# EAGLE design computer (EAGLE 7.1.0)
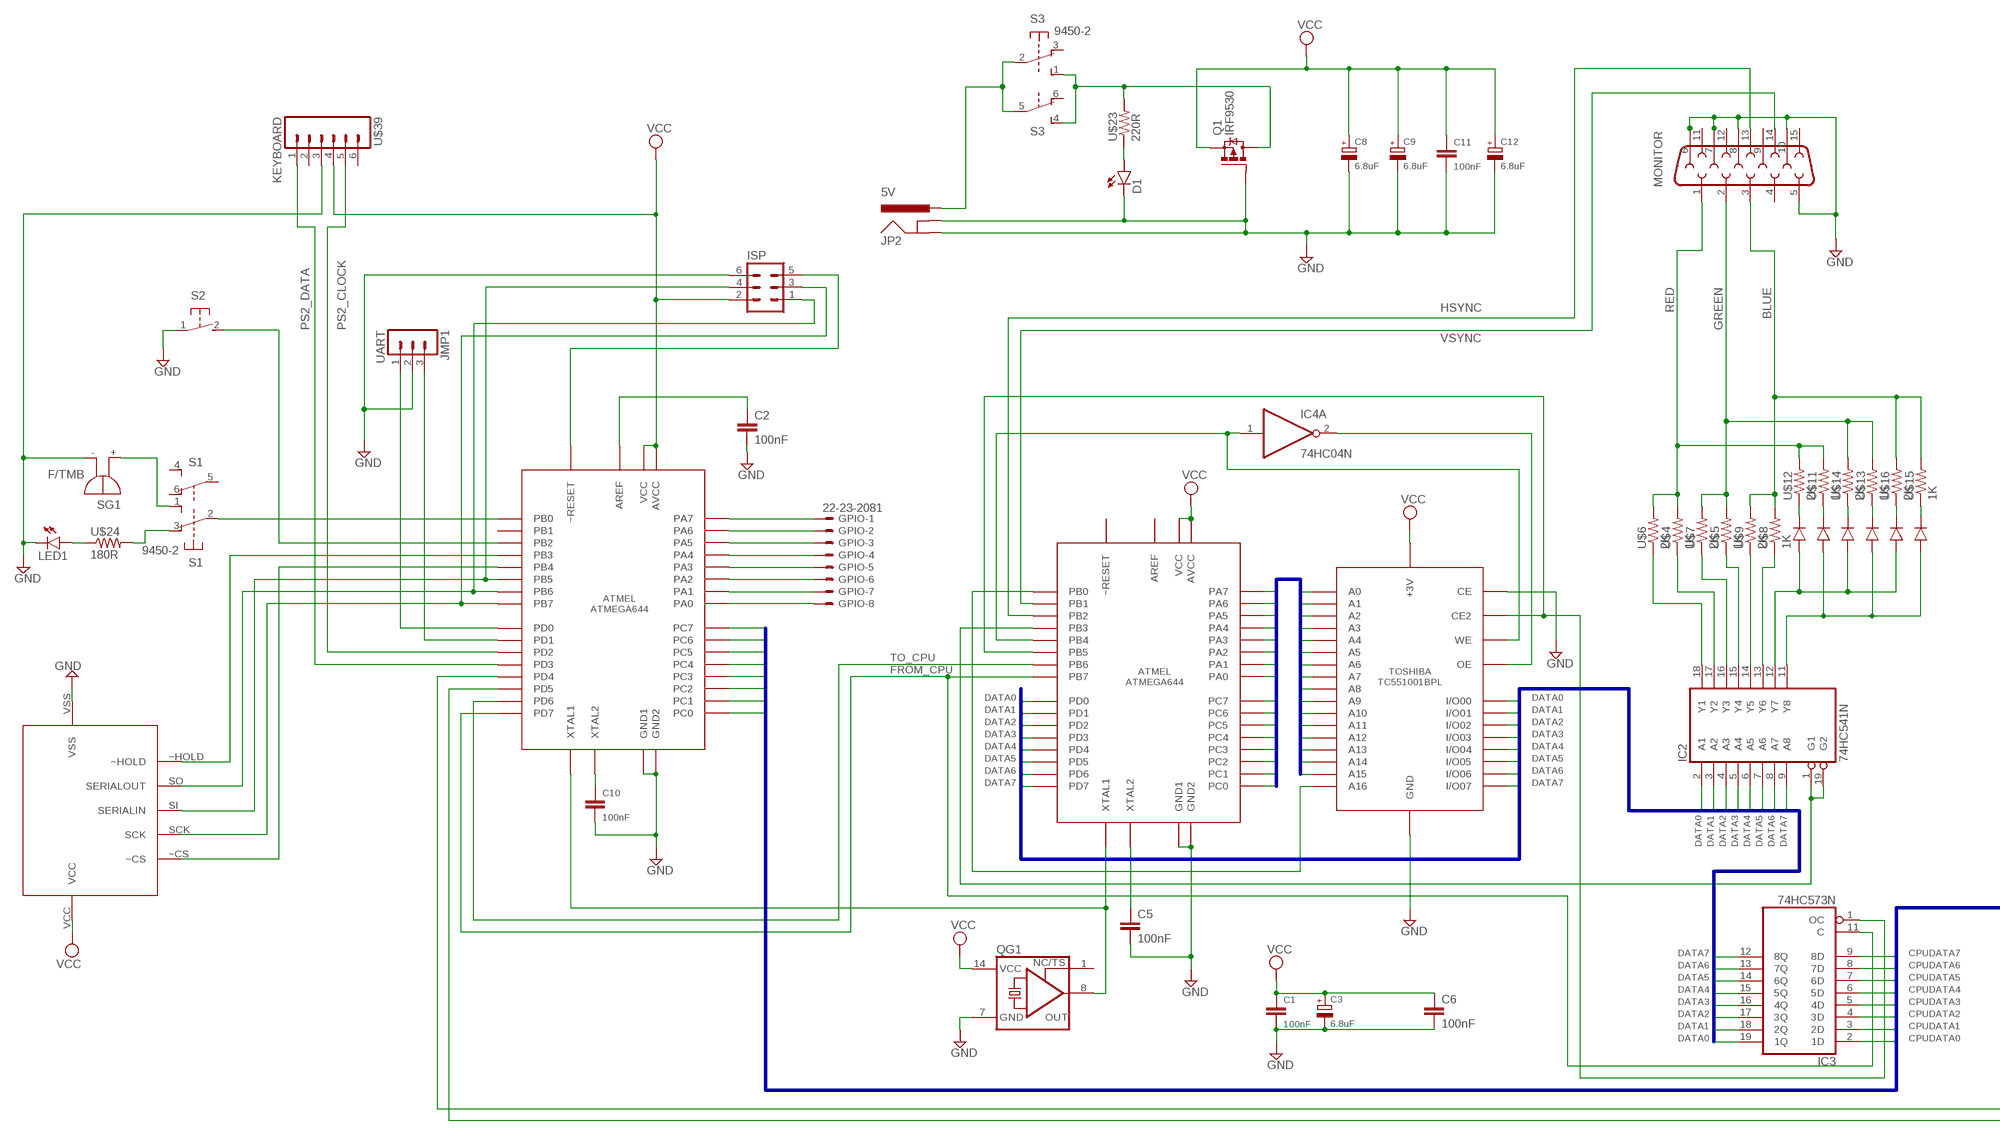
[diagram p0: schematic, sheet 1, part 1 of 2]
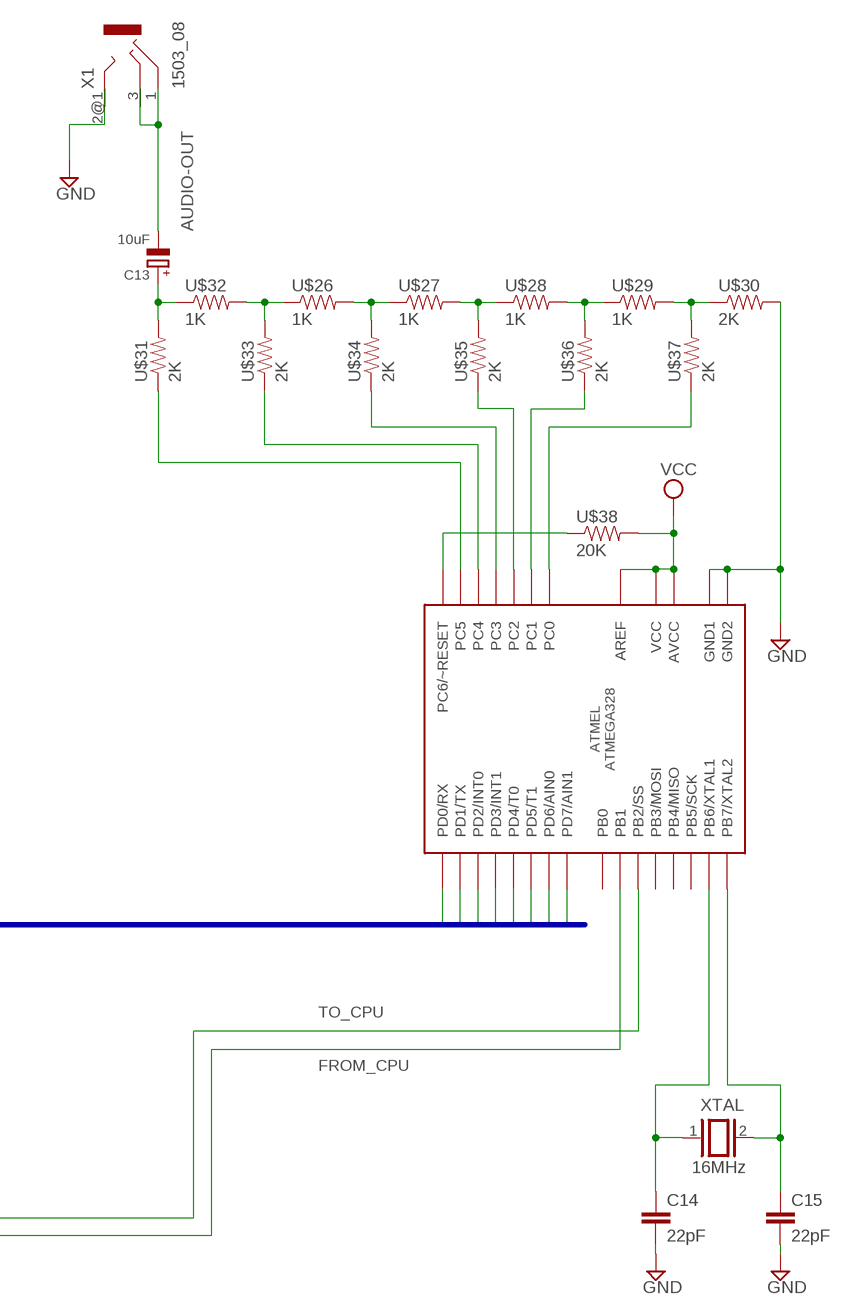
[diagram p1: schematic, sheet 1, part 2 of 2]

## Parts
C1  100nF  C5/2.5  [C5B2.5]
C2  100nF  CAPEZ  [CAP-PTH-SMALLEZ]
C3  6.8uF  CPOL-EUE5-5  [E5-5]
C5  100nF  CAPEZ  [CAP-PTH-SMALLEZ]
C6  100nF  CAPEZ  [CAP-PTH-SMALLEZ]
C8  6.8uF  CPOL-EUE5-5  [E5-5]
C9  6.8uF  CPOL-EUE5-5  [E5-5]
C10  100nF  C5/2.5  [C5B2.5]
C11  100nF  C5/2.5  [C5B2.5]
C12  6.8uF  CPOL-EUE5-5  [E5-5]
C13  10uF  CPOL-EUE5-5  [E5-5]
C14  22pF  CAPEZ  [CAP-PTH-SMALLEZ]
C15  22pF  CAPEZ  [CAP-PTH-SMALLEZ]
D1  LED5MM  [LED5MM]
GPIO  22-23-2081  [22-23-2081]
IC2  74HC541N  [DIL20]
IC3  74HC573N  [DIL20]
IC4  74HC04N  [DIL14]
ISP  ML6  [ML6]
JMP1  UART  MA03-1  [MA03-1]
JP2  5V  POWER_JACKPTH  [POWER_JACK_PTH]
LED1  LED5MM  [LED5MM]
Q1  IRF9530  [TO220BV]
QG1  XO-14  [DIL14S]
S1  9450-2  [9450-2]
S2  31-XX  [B3F-31XX]
S3  9450-2  [9450-2]
SG1  F/TMB  [F/TMB]
U$1  ATMEGA644  [ATMEGA644]
U$2  ATMEGA644  [ATMEGA644]
U$3  TC551001BPL  [TC551001BPL]
U$4  1K  RESISTOREZ  [AXIAL-0.3EZ]
U$5  1K  RESISTOREZ  [AXIAL-0.3EZ]
U$6  2K  RESISTOREZ  [AXIAL-0.3EZ]
U$7  2K  RESISTOREZ  [AXIAL-0.3EZ]
U$8  1K  RESISTOREZ  [AXIAL-0.3EZ]
U$9  2K  RESISTOREZ  [AXIAL-0.3EZ]
U$10  23LC1024  [23LC1024]
U$11  1K  RESISTOREZ  [AXIAL-0.3EZ]
U$12  2K  RESISTOREZ  [AXIAL-0.3EZ]
U$13  1K  RESISTOREZ  [AXIAL-0.3EZ]
U$14  2K  RESISTOREZ  [AXIAL-0.3EZ]
U$15  1K  RESISTOREZ  [AXIAL-0.3EZ]
U$16  2K  RESISTOREZ  [AXIAL-0.3EZ]
U$17  DIODE  [DIODE]
U$18  DIODE  [DIODE]
U$19  DIODE  [DIODE]
U$20  DIODE  [DIODE]
U$21  DIODE  [DIODE]
U$22  DIODE  [DIODE]
U$23  220R  RESISTOREZ  [AXIAL-0.3EZ]
U$24  180R  RESISTOREZ  [AXIAL-0.3EZ]
U$25  ATMEGA328  [ATMEGA328]
U$26  1K  RESISTOREZ  [AXIAL-0.3EZ]
U$27  1K  RESISTOREZ  [AXIAL-0.3EZ]
U$28  1K  RESISTOREZ  [AXIAL-0.3EZ]
U$29  1K  RESISTOREZ  [AXIAL-0.3EZ]
U$30  2K  RESISTOREZ  [AXIAL-0.3EZ]
U$31  2K  RESISTOREZ  [AXIAL-0.3EZ]
U$32  1K  RESISTOREZ  [AXIAL-0.3EZ]
U$33  2K  RESISTOREZ  [AXIAL-0.3EZ]
U$34  2K  RESISTOREZ  [AXIAL-0.3EZ]
U$35  2K  RESISTOREZ  [AXIAL-0.3EZ]
U$36  2K  RESISTOREZ  [AXIAL-0.3EZ]
U$37  2K  RESISTOREZ  [AXIAL-0.3EZ]
U$38  20K  RESISTOREZ  [AXIAL-0.3EZ]
U$39  KEYBOARD  MINI-DIN6PTH  [MINI-DIN6]
U$40  MONITOR  DB15  [DB15]
X1  1503_08  [1503_08]
XTAL  16MHz  XTAL/S  [QS]

## Nets
ADDRESS0: U$2.PC0 U$3.A0
ADDRESS1: U$2.PC1 U$3.A1
ADDRESS2: U$2.PC2 U$3.A2
ADDRESS3: U$2.PC3 U$3.A3
ADDRESS4: U$2.PC4 U$3.A4
ADDRESS5: U$2.PC5 U$3.A5
ADDRESS6: U$2.PC6 U$3.A6
ADDRESS7: U$2.PC7 U$3.A7
ADDRESS8: U$2.PA0 U$3.A8
ADDRESS9: U$2.PA1 U$3.A9
ADDRESS10: U$2.PA2 U$3.A10
ADDRESS11: U$2.PA3 U$3.A11
ADDRESS12: U$2.PA4 U$3.A12
ADDRESS13: U$2.PA5 U$3.A13
ADDRESS14: U$2.PA6 U$3.A14
ADDRESS15: U$2.PA7 U$3.A15
AUDIO-OUT: C13.- X1.1 X1.3
BLUE: U$8.P$2 U$9.P$2 U$15.P$2 U$16.P$2 U$40.3
CPUDATA0: IC3.2(1D) U$1.PC0 U$25.PD0/RX
CPUDATA1: IC3.3(2D) U$1.PC1 U$25.PD1/TX
CPUDATA2: IC3.4(3D) U$1.PC2 U$25.PD2/INT0
CPUDATA3: IC3.5(4D) U$1.PC3 U$25.PD3/INT1
CPUDATA4: IC3.6(5D) U$1.PC4 U$25.PD4/T0
CPUDATA5: IC3.7(6D) U$1.PC5 U$25.PD5(PD5/T1)
CPUDATA6: IC3.8(7D) U$1.PC6 U$25.PD6(PD6/AIN0)
CPUDATA7: IC3.9(8D) U$1.PC7 U$25.PD7(PD7/AIN1)
DATA0: IC2.2(A1) IC3.19(1Q) U$2.PD0 U$3.I/O1(I/O00)
DATA1: IC2.3(A2) IC3.18(2Q) U$2.PD1 U$3.I/O2(I/O01)
DATA2: IC2.4(A3) IC3.17(3Q) U$2.PD2 U$3.I/O3(I/O02)
DATA3: IC2.5(A4) IC3.16(4Q) U$2.PD3 U$3.I/O4(I/O03)
DATA4: IC2.6(A5) IC3.15(5Q) U$2.PD4 U$3.I/O5(I/O04)
DATA5: IC2.7(A6) IC3.14(6Q) U$2.PD5 U$3.I/O6(I/O05)
DATA6: IC2.8(A7) IC3.13(7Q) U$2.PD6 U$3.I/O7(I/O06)
DATA7: IC2.9(A8) IC3.12(8Q) U$2.PD7 U$3.I/O8(I/O07)
FROM_CPU: IC3.11(C) U$1.PD5 U$1.PD7 U$2.PB7 U$25.PB1
GND: C1.2 C2.2 C3.- C5.2 C6.2 C8.- C9.- C10.2 C11.2 C12.- C14.2 C15.2 D1.K(C) ISP.6 JMP1.2 JP2.GND JP2.GNDBREAK LED1.K(C) Q1.G QG1.7(GND) S2.1(P) SG1.- U$1.GND(GND1) U$1.GND.1(GND2) U$2.GND(GND1) U$2.GND.1(GND2) U$3.GND U$3.~CE1(CE) U$10.VSS U$25.GND1(GND2) U$25.GND(GND1) U$30.P$2 U$39.3 U$40.5 U$40.6 U$40.7 U$40.8 U$40.10 X1.2@1 X1.2@2
GREEN: U$5.P$2 U$7.P$2 U$13.P$2 U$14.P$2 U$40.2
HSYNC: U$2.PB2 U$40.13
N$1: QG1.8(OUT) U$1.XTAL1 U$2.XTAL1
N$2: U$12.P$1 U$17.CA(CATHODE)
N$3: IC4.2(A:O) U$3.~OE(OE)
N$4: GPIO.1 U$1.PA7
N$5: U$2.PB0 U$3.A16
N$6: IC2.1(G1) IC2.19(G2) U$2.PB3
N$7: C5.1 U$2.XTAL2
N$8: IC3.1(OC) U$2.PB5 U$3.CE2
N$9: C13.+ U$31.P$2 U$32.P$1
N$10: IC4.1(A:I) U$2.PB4 U$3.R/W(WE)
N$11: C10.1 U$1.XTAL2
N$12: U$11.P$1 U$18.CA(CATHODE)
N$13: U$14.P$1 U$19.CA(CATHODE)
N$14: U$13.P$1 U$20.CA(CATHODE)
N$15: U$16.P$1 U$21.CA(CATHODE)
N$16: U$15.P$1 U$22.CA(CATHODE)
N$17 [vcc]: JP2.PWR S3.2(1:P) S3.5(2:P)
N$18: S1.1(1:S) SG1.+
N$19: S1.3(1:O) U$24.P$2
N$20: LED1.A U$24.P$1
N$21: S1.2(1:P) U$1.PB0
N$22: JMP1.1 U$1.PD0
N$23: IC2.18(Y1) U$6.P$1
N$24: IC2.17(Y2) U$4.P$1
N$25: IC2.16(Y3) U$7.P$1
N$26: IC2.15(Y4) U$5.P$1
N$27: IC2.14(Y5) U$9.P$1
N$28: IC2.13(Y6) U$8.P$1
N$29: IC2.12(Y7) U$17.AN(ANODE) U$19.AN(ANODE) U$21.AN(ANODE)
N$30: IC2.11(Y8) U$18.AN(ANODE) U$20.AN(ANODE) U$22.AN(ANODE)
N$31: U$26.P$1 U$32.P$2 U$33.P$2
N$32: U$26.P$2 U$27.P$1 U$34.P$2
N$33: U$27.P$2 U$28.P$1 U$35.P$2
N$34: U$28.P$2 U$29.P$1 U$36.P$2
N$35: U$29.P$2 U$30.P$1 U$37.P$2
N$36: U$25.PC5/ADC5(PC5) U$31.P$1
N$37: U$25.PC4/ADC4(PC4) U$33.P$1
N$38: U$25.PC3/ADC3(PC3) U$34.P$1
N$39: U$25.PC2/ADC2(PC2) U$35.P$1
N$40: U$25.PC1/ADC1(PC1) U$36.P$1
N$41: U$25.PC0/ADC0(PC0) U$37.P$1
N$42: U$25.PC6/RESET(PC6/~RESET) U$38.P$1
N$43: C14.1 U$25.PB6(PB6/XTAL1) XTAL.1
N$44: C15.1 U$25.PB7(PB7/XTAL2) XTAL.2
N$45: C2.1 U$1.AREF
N$47: JMP1.3 U$1.PD1
N$48: ISP.3 U$1.PB7 U$10.SCK
N$49: S2.2(S) U$1.PB2
N$50: ISP.1 U$1.PB6 U$10.SO(SERIALOUT)
N$51: ISP.4 U$1.PB5 U$10.SI(SERIALIN)
N$52: U$1.PB4 U$10.~CS
N$53: U$1.PB3 U$10.~HOLD
N$54: GPIO.2 U$1.PA6
N$55: GPIO.3 U$1.PA5
N$56: GPIO.4 U$1.PA4
N$57: GPIO.5 U$1.PA3
N$58: GPIO.6 U$1.PA2
N$59: GPIO.7 U$1.PA1
N$60: GPIO.8 U$1.PA0
N$61: ISP.5 U$1.~RESET
N$64 [vcc]: Q1.D S3.1(1:S) S3.4(2:S) U$23.P$2
N$69: D1.A U$23.P$1
PS2_CLOCK: U$1.PD2 U$39.5
PS2_DATA: U$1.PD3 U$39.1
RED: U$4.P$2 U$6.P$2 U$11.P$2 U$12.P$2 U$40.1
TO_CPU: U$1.PD4 U$1.PD6 U$2.PB6 U$25.PB2/SS
VCC [vcc]: C1.1 C3.+ C6.1 C8.+ C9.+ C11.1 C12.+ ISP.2 Q1.S QG1.14(VCC) U$1.AVCC U$1.VCC U$2.AVCC U$2.VCC U$3.VDD(+3V) U$10.VCC U$25.AREF U$25.AVCC U$25.VCC U$38.P$2 U$39.4
VSYNC: U$2.PB1 U$40.14
Unconnected: IC4.3(B:I) IC4.4(B:O) IC4.5(C:I) IC4.6(C:O) IC4.8(D:O) IC4.9(D:I) IC4.10(E:O) IC4.11(E:I) IC4.12(F:O) IC4.13(F:I) QG1.1(TS) S1.4(2:S) S1.5(2:P) S1.6(2:O) S3.3(1:O) S3.6(2:O) U$1.PB1 U$2.AREF U$2.~RESET U$25.PB0 U$25.PB3/MOSI U$25.PB4/MISO U$25.PB5/SCK U$39.2 U$39.6 U$40.4 U$40.9 U$40.11 U$40.12 U$40.15

## Buses
DATA[0..7]
ADDRESS[0..15]
CPUDATA[0..7]

## Power pins joined to a net without a drawn wire
GND: IC2.10(GND) IC3.10(GND) IC4.7(P:GND)
VCC: IC2.20(VCC) IC3.20(VCC) IC4.14(P:VCC)

## Library data of the parts
C1 C10 C11 = capacitor-wima:C: CAPACITOR naming: grid - package width
C2 C5 C6 = SparkFun-Capacitors:CAP: Capacitor Standard 0603 ceramic capacitor, and 0.1" leaded capacitor.
C3 C8 C9 C12 C13 = rcl:CPOL-EU: POLARIZED CAPACITOR, European symbol
C14 C15 = SparkFun-Passives:CAP: Capacitor Standard 0603 ceramic capacitor, and 0.1" leaded capacitor.
D1 LED1 = SparkFun-LED:LED: LEDs Standard schematic elements and footprints for 5mm, 3mm, 1206, and 0603 sized LEDs. 5mm - Spark Fun Electronics SKU : COM-00529 (and others)
GPIO = con-molex:22-23-2081: .100" (2.54mm) Center Header - 8 Pin; MF: MOLEX; MPN: 22-23-2081; OC_FARNELL: 1756826; OC_NEWARK: 01C7592
IC2 = 74xx-eu:74*541: Octal BUFFER and LINE DRIVER, 3-state
IC3 = 74xx-eu:74*573: 8-bit D latch BUS DRIVER
IC4 = 74xx-eu:74*04: Hex INVERTER
ISP = con-ml:ML6: HARTING; OC_FARNELL: unknown; OC_NEWARK: unknown
JMP1 = con-lstb:MA03-1: PIN HEADER; OC_FARNELL: unknown; OC_NEWARK: unknown
JP2 = SparkFun-Connectors:POWER_JACK: Power Jack This is the standard 5.5mm barrel jack for power. The PTH is the most common, proven, reliable, footprint. The Slot footprint only works if the mill layer is transmitted to the PCB fab house so be warned. Mating wall wart : TOL-00298 (and others); PROD_ID: CONN-08197
Q1 = transistor-power:IRF9530: P-CHANNEL HEXFET POWER-MOS-FET Source: http://www.irf.com/product-info/datasheets/data/irf9530.pdf
QG1 = crystal:XO-: CRYSTAL; OC_FARNELL: unknown; OC_NEWARK: unknown
S1 S3 = switch-misc:9450-2: MARQUARDT SWITCH
S2 = switch-omron:31-XX: OMRON SWITCH; MPN: B3F-3100; OC_FARNELL: 959704; OC_NEWARK: 36M3582
SG1 = buzzer:F/TMB: BUZZER Source: Buerklin; OC_FARNELL: unknown; OC_NEWARK: unknown
U$1 U$2 = pvar_parts:ATMEGA644
U$3 = pvar_parts:TC551001BPL
U$4-U$9 U$11-U$16 U$23 U$24 U$26-U$38 = SparkFun-Resistors:RESISTOR: Resistor Basic schematic elements and footprints for 0603, 1206, and PTH resistors.
U$10 = pvar_parts:23LC1024: SPI SRAM 128K x 8bit
U$17-U$22 = pvar_parts:DIODE
U$25 = pvar_parts:ATMEGA328
U$39 = SparkFun-Connectors:MINI-DIN6: mini DIN 6 Connector Commonly found on the back of a computer for PS2 keyboard and mice. Schematic and footprint are proven. Spark Fun Electronics SKU : PRT-08509
U$40 = SparkFun-Connectors:DB15: DB15 / VGA right angle through-hole female connector.
X1 = con-lumberg:1503_?: Jack connectors according to JISC 6560, 3.5 mm Klinkensteckverbinder nach JISC 6560, 3,5 mm Source: http://www.lumberg.com/Produkte/PDFs/1503_08.pdf; OC_FARNELL: unknown; OC_NEWARK: unknown
XTAL = special:XTAL/S: CRYSTAL

## Net classes
1 vcc: width 0.381 mm

## Board
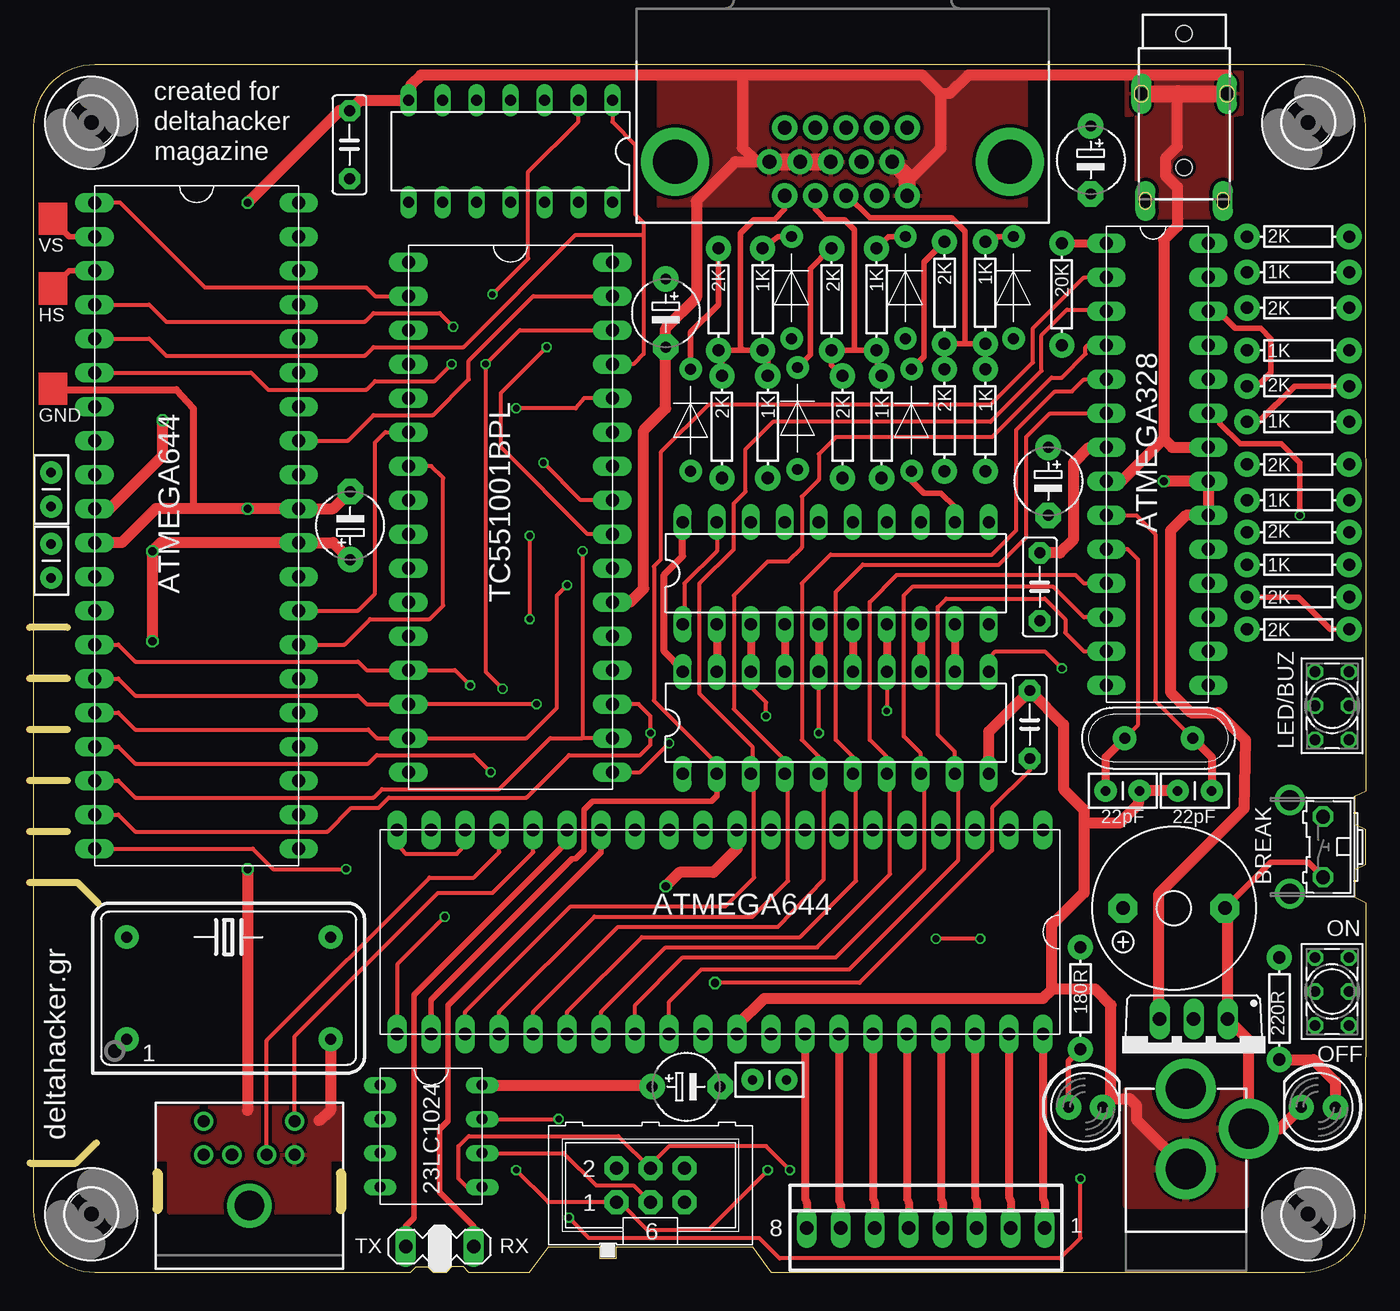
[diagram p2: board, top side]
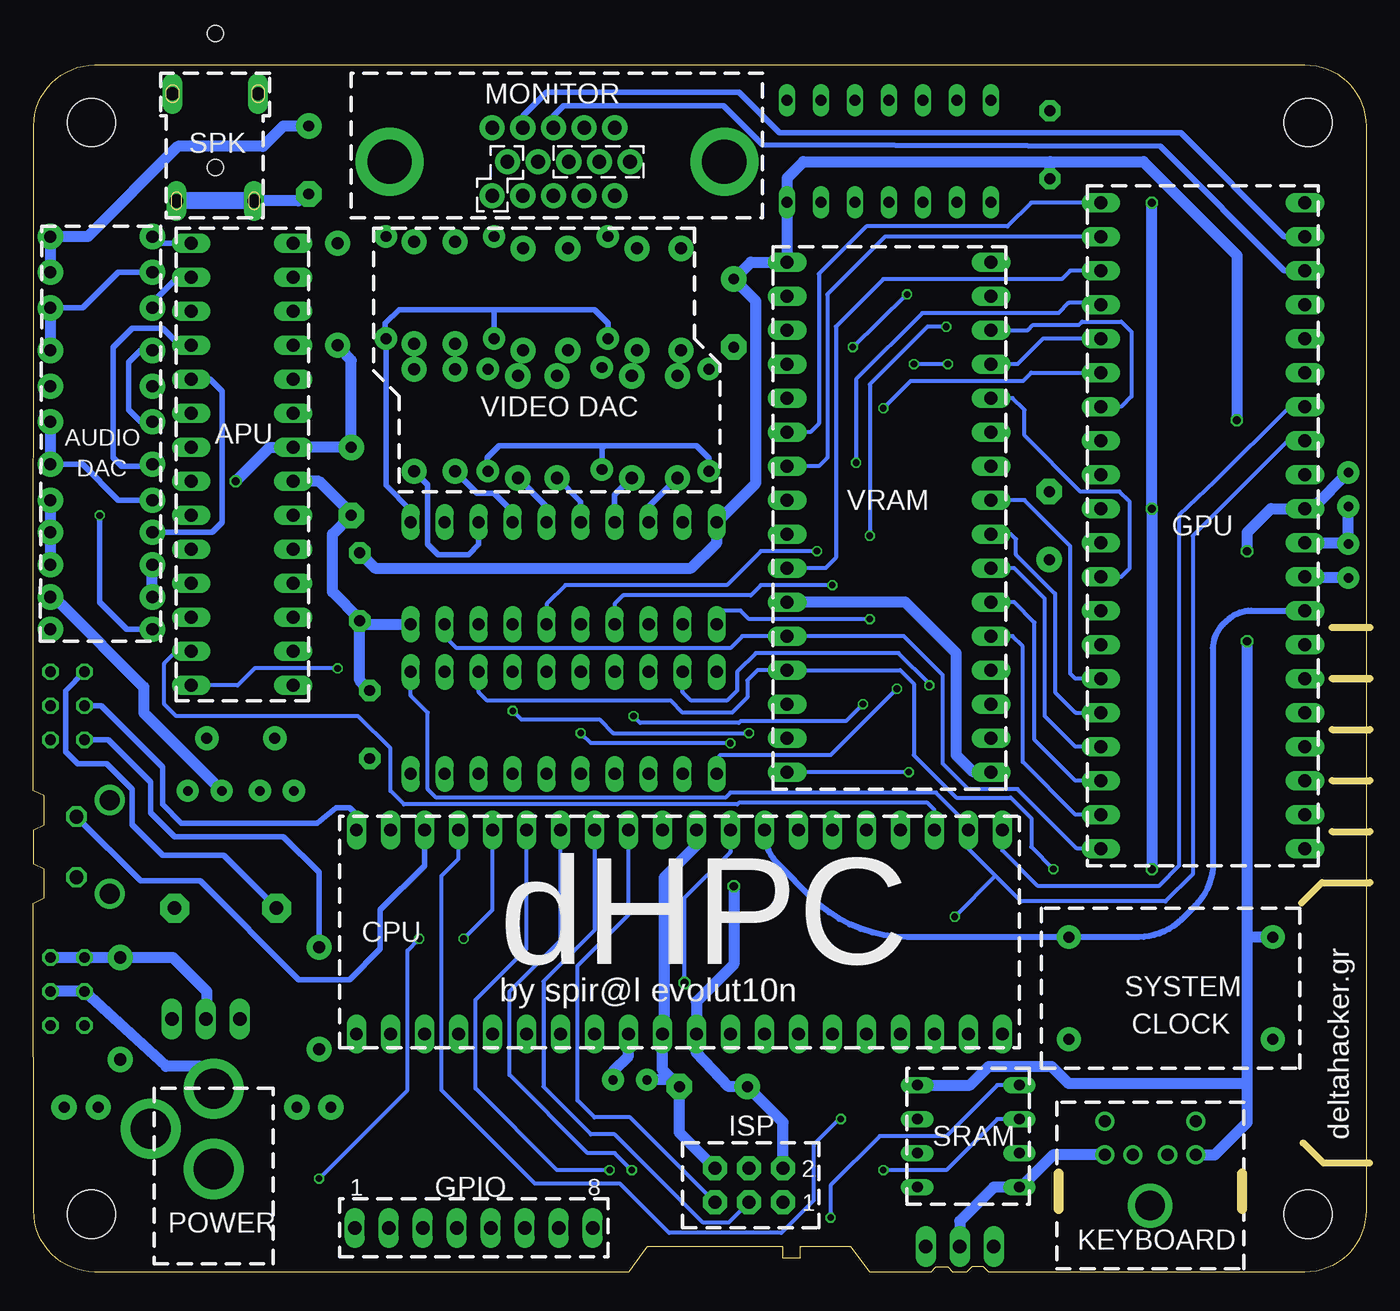
[diagram p3: board, bottom side, seen from below]

Size 99.57 x 90.17 mm. Coordinates in mm from the lower left corner, seen from the top.
Outline: 26.8,90.17 4.57,90.17 arc90 0,85.6 0,4.57 arc90 4.57,0 28.19,0 28.57,0.38 29.46,0.38 29.84,0 30.86,0 31.24,0.38 32.13,0.38 32.51,0 37.08,0 38.48,1.9 42.29,1.9 42.29,1.02 43.56,1.02 43.56,1.9 53.72,1.9 55.12,0 94.98,0 arc90 99.55,4.57 99.57,27.56 98.75,27.94 98.75,30.1 99.55,30.46 99.55,33.04 98.75,33.4 98.75,35.56 99.57,35.94 99.55,85.6 arc90 94.98,90.17 26.8,90.17
Copper layers (1*16): Top 0.018mm / dielectric 1.55mm / Bottom 0.018mm
Design rules "eC_2Layer_PClass6_BaseCopperO18_eCDefault": minimum track width 0.15mm, minimum drill 0.35mm, track to track 0.15mm, track to pad 0.15mm, pad to pad 0.15mm, via to via 0.15mm, smd to smd 0mil, copper to edge 0.25mm, drill to drill 0.35mm, minimum pad ring 0.175mm, minimum via ring 0.125mm, stop-mask expansion 0mil, vias tented up to drill 0.45mm, thermal gap 0.2mm
Milling: 12 lines

### Footprints (pad centres in the part's own frame; a part is rotated, then mirrored left to right if it is on the bottom)
C5B2.5 = drill 0.813 pad 1.6 octagon: 1 -2.54,0; 2 2.54,0
CAP-PTH-SMALLEZ = drill 0.7 pad 1.651: 1 0,0; 2 2.54,0
E5-5 = drill 0.813 pad 1.905: + -2.54,0 | drill 0.813 pad 1.905 octagon: - 2.54,0
LED5MM = drill 0.813 pad 1.88: A -1.27,0; K 1.27,0
22-23-2081 = drill 1 long: 1 -8.89,0; 2 -6.35,0; 3 -3.81,0; 4 -1.27,0; 5 1.27,0; 6 3.81,0; 7 6.35,0; 8 8.89,0
3,6 = hole 3.6: 0,0
DIL20 = drill 0.9 long: 1 -11.43,-3.81; 2 -8.89,-3.81; 3 -6.35,-3.81; 4 -3.81,-3.81; 5 -1.27,-3.81; 6 1.27,-3.81; 7 3.81,-3.81; 8 6.35,-3.81; 9 8.89,-3.81; 10 11.43,-3.81; 11 11.43,3.81; 12 8.89,3.81; 13 6.35,3.81; 14 3.81,3.81; 15 1.27,3.81; 16 -1.27,3.81; 17 -3.81,3.81; 18 -6.35,3.81; 19 -8.89,3.81; 20 -11.43,3.81
DIL14 = drill 0.813 long: 1 -7.62,-3.81; 2 -5.08,-3.81; 3 -2.54,-3.81; 4 0,-3.81; 5 2.54,-3.81; 6 5.08,-3.81; 7 7.62,-3.81; 8 7.62,3.81; 9 5.08,3.81; 10 2.54,3.81; 11 0,3.81; 12 -2.54,3.81; 13 -5.08,3.81; 14 -7.62,3.81
ML6 = drill 0.991 pad 1.778 octagon: 1 -2.54,-1.27; 2 -2.54,1.27; 3 0,-1.27; 4 0,1.27; 5 2.54,-1.27; 6 2.54,1.27
MA03-1 = drill 1.016 long: 1 -2.54,0; 2 0,0; 3 2.54,0
POWER_JACK_PTH = drill 2.997 pad 4.318: GND 0,7.7; GNDBREAK 4.7,10.7; PWR 0,13.7
TO220BV = drill 1.016 long: D 0,-2.54; G -2.54,-2.54; S 2.54,-2.54
DIL14S = drill 0.813 pad 1.778: 1 -7.62,-3.81; 7 7.62,-3.81; 8 7.62,3.81; 14 -7.62,3.81
9450-2 = drill 0.813 octagon: 1 -2.54,-1.27; 2 0,-1.27; 3 2.54,-1.27; 4 -2.54,1.27; 5 0,1.27; 6 2.54,1.27
B3F-31XX = drill 1.016 octagon: 1 -2.261,-1.245; 2 2.261,-1.245 | drill 1.499 pad 2.159: 3 -3.505,1.245; 4 3.505,1.245
F/TMB = drill 1.016 pad 2.159 octagon: + 3.81,0; - -3.81,0
ATMEGA644 = drill 0.965 long: AREF 7.62,2.54; AVCC 7.62,-2.54; GND -7.62,-2.54; GND.1 7.62,0; PA0 7.62,22.86; PA1 7.62,20.32; PA2 7.62,17.78; PA3 7.62,15.24; PA4 7.62,12.7; PA5 7.62,10.16; PA6 7.62,7.62; PA7 7.62,5.08; PB0 -7.62,22.86; PB1 -7.62,20.32; PB2 -7.62,17.78; PB3 -7.62,15.24; PB4 -7.62,12.7; PB5 -7.62,10.16; PB6 -7.62,7.62; PB7 -7.62,5.08; PC0 7.62,-22.86; PC1 7.62,-20.32; PC2 7.62,-17.78; PC3 7.62,-15.24; PC4 7.62,-12.7; PC5 7.62,-10.16; PC6 7.62,-7.62; PC7 7.62,-5.08; PD0 -7.62,-10.16; PD1 -7.62,-12.7; PD2 -7.62,-15.24; PD3 -7.62,-17.78; PD4 -7.62,-20.32; PD5 -7.62,-22.86; PD6 -7.62,-25.4; PD7 7.62,-25.4; VCC -7.62,0; XTAL1 -7.62,-7.62; XTAL2 -7.62,-5.08; ~RESET -7.62,2.54
TC551001BPL = drill 0.965 long: A0 -7.62,-10.16; A1 -7.62,-7.62; A2 -7.62,-5.08; A3 -7.62,-2.54; A4 -7.62,0; A5 -7.62,2.54; A6 -7.62,5.08; A7 -7.62,7.62; A8 7.62,5.08; A9 7.62,2.54; A10 7.62,-5.08; A11 7.62,0; A12 -7.62,10.16; A13 7.62,7.62; A14 -7.62,12.7; A15 7.62,15.24; A16 -7.62,15.24; CE2 7.62,12.7; GND -7.62,-20.32; I/O1 -7.62,-12.7; I/O2 -7.62,-15.24; I/O3 -7.62,-17.78; I/O4 7.62,-20.32; I/O5 7.62,-17.78; I/O6 7.62,-15.24; I/O7 7.62,-12.7; I/O8 7.62,-10.16; N.C. -7.62,17.78; R/W 7.62,10.16; VDD 7.62,17.78; ~CE1 7.62,-7.62; ~OE 7.62,-2.54
AXIAL-0.3EZ = drill 0.9 pad 1.88: P$1 -3.81,0; P$2 3.81,0
23LC1024 = drill 0.813 long: NC -3.81,-1.27; SCK 3.81,-1.27; SI 3.81,-3.81; SO -3.81,1.27; VCC 3.81,3.81; VSS -3.81,-3.81; ~CS -3.81,3.81; ~HOLD 3.81,1.27
DIODE = drill 0.813 pad 1.676: AN 3.81,0; CA -3.81,0
ATMEGA328 = drill 0.965 pad 1.422 long: AREF 3.81,-2.54; AVCC 3.81,-5.08; GND -3.81,-2.54; GND1 3.81,0; PB0 -3.81,-17.78; PB1 3.81,-17.78; PB2/SS 3.81,-15.24; PB3/MOSI 3.81,-12.7; PB4/MISO 3.81,-10.16; PB5/SCK 3.81,-7.62; PB6 -3.81,-5.08; PB7 -3.81,-7.62; PC0/ADC0 3.81,2.54; PC1/ADC1 3.81,5.08; PC2/ADC2 3.81,7.62; PC3/ADC3 3.81,10.16; PC4/ADC4 3.81,12.7; PC5/ADC5 3.81,15.24; PC6/RESET -3.81,15.24; PD0/RX -3.81,12.7; PD1/TX -3.81,10.16; PD2/INT0 -3.81,7.62; PD3/INT1 -3.81,5.08; PD4/T0 -3.81,2.54; PD5 -3.81,-10.16; PD6 -3.81,-12.7; PD7 -3.81,-15.24; VCC -3.81,0
MINI-DIN6 = drill 0.9 pad 1.422: 1 -1.3,-8.5; 2 1.3,-8.5; 3 -3.4,-8.5; 4 3.4,-8.5; 5 -3.4,-11; 6 3.4,-11 | drill 2.2: P$1 0,-4.7
DB15 = drill 1.016 pad 1.88: 1 -4.32,-7.62; 2 -2.03,-7.62; 3 0.26,-7.62; 4 2.55,-7.62; 5 4.84,-7.62; 6 -5.46,-5.08; 7 -3.17,-5.08; 8 -0.88,-5.08; 9 1.41,-5.08; 10 3.7,-5.08; 11 -4.32,-2.54; 12 -2.03,-2.54; 13 0.26,-2.54; 14 2.55,-2.54; 15 4.84,-2.54 | drill 3.302 pad 5.08: G1 -12.5,-5.08; G2 12.5,-5.08
1503_08 = drill 1 pad 1.2 long: 1 -2.9,-8; 2@1 -3.2,0; 2@2 3.2,0; 3 2.9,-8 | hole 1.2: 0,4.5; 0,-5.5
QS = drill 0.813 pad 1.778: 1 -2.54,0; 2 2.54,0

### Placement (x,y rotation side)
C1  23.62,84.2 90 top
C2  56.26,14.35 180 top
C3  75.82,59.06 270 top
C5  1.32,51.85 90 top
C6  1.32,59.72 270 top
C8  47.24,71.63 270 top
C9  23.67,55.75 90 top
C10  74.45,40.89 90 top
C11  75.18,51.18 270 top
C12  48.77,13.84 0 top
C13  78.99,83.06 270 top
C14  88.04,35.94 180 top
C15  80.11,35.94 0 top
D1  96.01,12.32 180 top
GPIO  66.68,3.3 0 top
H1  MOUNT-HOLE3.0  [3,6]  4.32,85.85 0 top
H2  MOUNT-HOLE3.0  [3,6]  95.25,85.85 0 top
H4  MOUNT-HOLE3.0  [3,6]  95.25,4.32 0 top
H5  MOUNT-HOLE3.0  [3,6]  4.32,4.32 0 top
IC2  59.94,52.2 0 top
IC3  59.94,41.02 0 top
IC4  35.64,83.72 180 top
ISP  46.1,6.48 0 top
JMP1  30.35,1.9 180 top
JP2  86.11,0 0 top
LED1  78.61,12.32 0 top
Q1  86.69,16.36 180 top
QG1  14.58,21.21 0 top
S1  97.03,42.29 270 top
S2  95.12,31.75 90 top
S3  97.03,20.95 270 top
SG1  85.22,27.18 180 top
U$1  52.58,25.4 270 top
U$2  12.19,57.02 0 top
U$3  35.64,57.66 0 top
U$4  54.86,63.12 90 top
U$5  63.37,63.12 90 top
U$6  51.43,63.12 90 top
U$7  60.45,63.12 90 top
U$8  71.12,63.63 90 top
U$9  68.07,63.63 90 top
U$10  29.72,10.16 0 top
U$11  54.48,72.64 270 top
U$12  51.18,72.64 270 top
U$13  62.99,72.64 270 top
U$14  59.64,72.64 270 top
U$15  71.12,73.15 270 top
U$16  68.07,73.15 270 top
U$17  49.1,63.63 270 top
U$18  56.64,73.53 270 top
U$19  57.1,63.75 270 top
U$20  65.15,73.53 270 top
U$21  65.61,63.63 270 top
U$22  73.23,73.53 270 top
U$23  93.09,19.68 90 top
U$24  78.23,20.45 90 top
U$25  83.97,61.59 0 top
U$26  94.49,68.83 180 top
U$27  94.49,63.5 0 top
U$28  94.49,57.66 0 top
U$29  94.49,52.83 180 top
U$30  94.49,50.42 0 top
U$31  94.49,77.34 0 top
U$32  94.49,74.68 180 top
U$33  94.49,72.01 0 top
U$34  94.49,66.17 0 top
U$35  94.49,60.33 0 top
U$36  94.49,55.25 0 top
U$37  94.49,48.01 0 top
U$38  76.84,73.03 270 top
U$39  16.13,0.25 180 top
U$40  60.45,88.01 0 top
X1  85.98,88.01 0 top
XTAL  84.07,39.88 180 top

### Tracks (layer width: path | path; a pad name or v marks a point on that pad's centre or on a via)
ADDRESS0
  Bottom 0.305: U$3.A0 26.42,47.5 25.65,46.74 25.65,38.1 21.72,34.16 U$2.PC0
ADDRESS1
  Bottom 0.305: U$3.A1 26.29,50.04 24.76,48.51 24.76,39.75 21.72,36.7 U$2.PC1
ADDRESS2
  Bottom 0.305: U$3.A2 26.29,52.58 24,50.29 24,41.53 21.72,39.24 U$2.PC2
ADDRESS3
  Bottom 0.305: U$3.A3 26.54,55.12 26.16,54.74 26.16,53.59 23.24,50.67 23.24,43.31 21.72,41.78 U$2.PC3
ADDRESS4
  Bottom 0.305: U$2.PC4 21.72,44.32 22.1,44.7 22.1,54.23 25.53,57.66 U$3.A4
ADDRESS5
  Top 0.305: U$2.PC5 23.24,46.86 25.15,48.77 29.59,48.77 30.61,49.78 30.61,59.31 29.72,60.2 U$3.A5
ADDRESS6
  Top 0.305: U$2.PC6 24.26,49.4 25.53,50.67 25.53,61.98 26.29,62.74 U$3.A6
ADDRESS7
  Bottom 0.305: U$2.PC7 18.29,51.94 17.65,52.58 17.65,57.53 18.41,58.29 21.34,58.29 25.53,62.48 25.53,64.39 26.42,65.28 U$3.A7
ADDRESS8
  Bottom 0.305: U$2.PA0 25.02,79.88 26.8,78.11 37.34,78.11 40.89,74.55 40.89,63.37 41.53,62.74 U$3.A8
ADDRESS9
  Bottom 0.305: U$2.PA1 35.94,77.34 40.26,73.03 40.26,60.83 40.89,60.2 U$3.A9
ADDRESS10
  Bottom 0.305: U$2.PA2 22.1,74.8 22.73,74.17 36.07,74.17 39.62,70.61 39.62,53.34 40.39,52.58 U$3.A10
ADDRESS11  (via drill 0.5)
  Top 0.305: U$3.A11 40.89,57.66 v38.1,60.45
  Bottom 0.305: U$2.PA3 19.94,72.39 22.23,72.39 22.99,71.63 33.15,71.63 38.1,66.67 v38.1,60.45
ADDRESS12
  Bottom 0.305: U$2.PA4 24.13,69.72 26.04,67.82 U$3.A12
ADDRESS13  (via drill 0.5)
  Top 0.305: U$3.A13 41.15,65.28 40.51,64.52 v36.07,64.52
  Bottom 0.305: U$2.PA5 25.02,67.18 25.65,66.55 34.04,66.55 v36.07,64.52
ADDRESS14
  Bottom 0.305: U$3.A14 25.27,70.36 24.89,70.74 21.46,70.74 21.21,70.99 18.29,70.99 17.53,70.23 17.53,65.41 18.29,64.64 U$2.PA6
ADDRESS15
  Top 0.305: U$2.PA7 23.49,62.1 25.4,64.01 29.84,64.01 32.51,66.67 32.51,68.07 37.34,72.9 U$3.A15
AUDIO-OUT
  Bottom 0.813: C13.- 79.75,80.01 X1.1
  Bottom 1.27: X1.1 X1.3
BLUE
  Top 0.406: U$9.P$2 U$16.P$2 69.6,69.34 | 69.6,69.34 U$15.P$2 U$8.P$2 | U$40.3 60.83,80.39 62.48,78.74 68.58,78.74 69.6,77.72 69.6,69.34
CPUDATA0
  Top 0.305: IC3.2 51.05,37.97 46.35,42.67 46.35,52.7 46.86,53.21 46.86,61.21 50.42,64.77 71.5,64.77 74.68,67.95 74.68,70.48 78.49,74.3 U$25.PD0/RX
  Top 0.406: U$1.PC0 29.72,20.32 40.26,30.86 40.51,30.86 41.15,31.5 41.15,34.54 41.78,35.18 50.67,35.18 51.05,35.56 IC3.2 51.05,36.96
CPUDATA1
  Top 0.305: U$1.PC1 32.26,19.43 40.13,27.31 51.69,27.31 53.85,29.46 53.85,36.7 53.59,36.96 IC3.3 53.72,37.34 53.72,39.24 49.78,43.18 49.78,51.44 52.32,53.98 52.32,57.4 53.21,58.29 53.21,61.47 55.24,63.5 71.5,63.5 75.31,67.31 75.31,69.98 77.22,71.88 80.03,71.88 U$25.PD1/TX
CPUDATA2
  Top 0.305: U$1.PC2 34.8,19.43 41.91,26.54 53.72,26.54 56.39,29.21 56.39,36.7 56.13,36.96 IC3.4 56.13,38.23 52.32,42.04 52.32,50.55 54.86,53.09 56.39,53.09 57.4,54.1 57.4,57.91 58.67,59.18 58.67,61.09 59.94,62.36 71.63,62.36 76.07,66.8 76.84,66.8 78.61,68.58 78.61,69.09 78.74,69.22 U$25.PD2/INT0
CPUDATA3
  Top 0.305: U$1.PC3 37.34,19.43 43.69,25.78 55.63,25.78 59.05,29.34 59.05,36.83 IC3.5 58.67,38.48 57.4,39.75 57.4,51.44 59.56,53.59 71.63,53.59 73.41,55.37 73.41,62.87 76.33,65.79 77.6,65.79 78.49,66.67 U$25.PD3/INT1
CPUDATA4
  Top 0.305: U$1.PC4 39.88,19.43 45.47,25.02 57.28,25.02 61.47,29.21 61.47,36.83 61.21,37.08 IC3.6 61.21,38.48 59.94,39.75 59.94,50.8 61.98,52.83 72.14,52.83 74.17,54.86 74.17,62.36 75.95,64.14 U$25.PD4/T0
CPUDATA5
  Top 0.305: U$1.PC5 42.42,19.43 47.24,24.26 58.55,24.26 64.01,29.72 64.01,36.7 63.75,36.96 IC3.7 63.75,38.48 62.48,39.75 62.48,50.04 64.52,52.07 77.85,52.07 78.49,51.44 U$25.PD5
CPUDATA6
  Top 0.305: U$1.PC6 44.96,19.94 48.51,23.5 59.94,23.5 66.55,30.1 66.55,36.96 IC3.8 66.29,38.73 65.02,40 65.02,50.55 65.66,51.18 76.2,51.18 78.49,48.89 U$25.PD6
CPUDATA7
  Top 0.305: U$1.PC7 47.5,20.19 49.91,22.61 60.96,22.61 69.09,30.73 69.09,36.96 IC3.9 68.83,38.86 67.56,40.13 67.56,49.66 68.2,50.29 75.56,50.29 77.09,48.77 77.09,47.75 78.49,46.36 U$25.PD7
DATA0  (via drill 0.5)
  Top 0.305: U$2.PD0 6.35,46.86 7.62,45.59 24.26,45.59 24.89,44.96 U$3.I/O1 31.5,44.96 v32.64,43.81
  Top 0.61: IC2.2 IC3.19
  Bottom 0.305: v32.64,43.81 32.64,43.94 34.93,46.23 45.59,46.23 46.99,44.83 46.99,43.43 47.75,42.67 50.42,42.67 51.05,43.31 IC3.19
DATA1  (via drill 0.5)
  Top 0.305: U$2.PD1 6.35,44.32 7.62,43.05 24.26,43.05 24.89,42.42 U$3.I/O2 v37.59,42.42 | v54.74,41.53 54.74,42.55 53.59,43.69 IC3.18
  Top 0.61: IC2.3 IC3.18
  Bottom 0.305: v37.59,42.42 38.86,41.15 46.74,41.15 46.86,41.02 54.23,41.02 v54.74,41.53
DATA2  (via drill 0.5)
  Top 0.305: U$2.PD2 6.35,41.78 7.62,40.51 25.02,40.51 25.65,39.88 U$3.I/O3 36.83,39.88 39.12,42.16 39.12,50.55 v39.88,51.31
  Top 0.61: IC2.4 IC3.17
  Bottom 0.305: v39.88,51.31 45.21,51.31 45.97,50.55 55.5,50.55 56.13,49.91 IC2.4
DATA3  (via drill 0.5)
  Top 0.305: U$2.PD3 6.35,39.24 7.62,37.97 25.02,37.97 25.65,38.61 32.89,38.61 v34.16,37.34 | U$3.I/O4 45.34,37.34 v47.5,39.5 | v58.67,40.26 IC3.16
  Top 0.61: IC2.5 IC3.16
  Bottom 0.305: v34.16,37.34 U$3.I/O4 | v47.5,39.5 57.91,39.5 v58.67,40.26
DATA4  (via drill 0.5)
  Top 0.305: U$2.PD4 6.35,36.7 7.62,35.43 25.4,35.43 26.04,36.07 34.8,36.07 38.61,39.88 41.02,39.88 | U$3.I/O5 41.02,39.88 | v41.02,53.85 41.02,39.88
  Top 0.61: IC2.6 IC3.15
  Bottom 0.305: v41.02,53.85 45.21,53.85 47.75,51.31 59.82,51.31 61.21,49.91 IC2.6
DATA5  (via drill 0.5)
  Top 0.305: U$2.PD5 6.35,34.16 7.62,32.89 21.97,32.89 23.75,34.67 25.78,34.67 26.54,35.43 36.83,35.43 40.01,38.61 45.34,38.61 46.1,39.37 v46.1,40.26 46.1,41.53 45.21,42.42 U$3.I/O6 | IC3.14 v63.75,41.91
  Top 0.61: IC2.7 IC3.14
  Bottom 0.305: v63.75,41.91 63.12,41.28 57.28,41.28 56.26,40.26 v46.1,40.26
DATA6  (via drill 0.5)
  Top 0.305: U$2.PD6 16.38,31.62 17.91,30.1 v23.37,30.1
  Top 0.61: IC2.8 IC3.13
  Bottom 0.305: v23.37,30.1 25.02,31.75 25.02,33.91 26.54,35.43 30.61,35.43 33.78,38.61 33.78,43.94 34.8,44.96 U$3.I/O7 45.47,44.96 46.23,44.2 46.23,42.93 47.37,41.78 51.05,41.78 51.94,42.67 65.66,42.67 66.29,43.31 IC3.13
DATA7
  Top 0.61: IC2.9 IC3.12
  Bottom 0.305: U$2.PD7 21.59,31.62 26.04,36.07 29.72,36.07 31.62,37.97 31.62,44.58 34.54,47.5 U$3.I/O8 46.61,47.5 47.5,46.61 67.94,46.61 68.83,47.5 IC2.9
FROM_CPU  (via drill 0.5)
  Top 0.305: v30.73,26.54 27.18,22.99 U$1.PD7 | IC3.11 71.5,44.96 71.5,45.97 71.88,46.36 75.56,46.36 v76.84,45.08
  Bottom 0.305: v76.84,45.08 83.06,45.08 84.33,43.81 U$25.PB1 | IC3.11 71.37,43.05 70.1,41.78 70.1,36.07 69.47,35.43 47.88,35.43 47.5,35.81 32.13,35.81 29.84,33.53 29.84,33.2 U$1.PD5 29.72,31.62 27.69,29.59 | U$2.PB7 5.84,62.1 12.95,54.99 12.95,29.72 14.99,27.69 25.78,27.69 27.69,29.59 | v30.73,26.54 27.69,29.59
GND  (via drill 0.6)
  Top 0.406: S2.1 95.25,30.61 92.46,30.61 SG1.-
  Top 0.508: 2.41,65.91 10.67,65.91 11.94,64.52 11.94,57.02
  Top 0.813: U$25.GND1 85.09,61.59 84.45,62.23 | U$2.GND 6.6,54.48 9.14,57.02 11.94,57.02 v16,57.02 U$2.GND.1 22.4,57.02 C9.- | 67.82,88.01 67.82,83.95 65.29,81.42 65.29,81.79 | 67.82,88.01 66.42,89.41 52.96,89.41 | 52.96,89.41 28.96,89.41 28.19,88.65 28.19,87.61 IC4.7 24.41,87.53 C1.2 22.86,86.74 v16,79.88 | 52.96,89.41 52.96,83.95 54.1,82.93 | 54.1,82.93 U$40.6 54.61,82.93 | v16,30.1 16,12.07 | IC3.10 71.37,40.36 C10.2 74.45,43.41 76.96,40.89 76.96,36.07 78.49,34.54 78.49,33.66 | U$1.GND.1 52.58,18.41 54.61,20.45 75.44,20.45 76.12,21.13 | U$3.~CE1 44.58,50.04 45.59,51.05 45.59,62.87 47.24,64.52 C8.- 47.24,70.48 49.53,72.77 49.53,80.01 52.45,82.93 54.1,82.93 | QG1.7 22.2,12.04 21.34,11.3 | 76.12,21.13 79.33,21.13 80.52,19.94 80.52,12.95 | SG1.- 89.23,26.97 Q1.G 90.81,17.32 JP2.GNDBREAK 93.12,10.7 D1.K | C14.2 C15.2 82.55,35.84 82.55,34.92 81.15,33.53 78.61,33.53 78.49,33.66 | 78.49,33.66 78.49,28.32 76.07,25.91 76.07,21.17 76.12,21.13 | LED1.K 80.52,12.95 | 80.52,12.95 81.91,12.95 82.42,12.45 82.42,11.38 JP2.GND | 67.82,88.01 68.45,88.01 69.85,89.41 89.18,89.41 X1.2@2 | 85.47,88.01 85.47,84.07 84.58,83.19 84.58,81.92 85.47,81.03 85.47,78.11 84.45,77.09 84.45,62.23 | U$25.GND 81.28,59.06 84.45,62.23
  Top 1.27: U$40.5 65.29,81.42 | U$40.10 65.29,81.79 | U$40.6 U$40.7 U$40.8 | X1.2@1 85.47,88.01 X1.2@2
  Bottom 0.61: 52.45,18.21 U$1.GND.1
  Bottom 0.813: U$1.GND 50.04,31.88 52.45,29.46 52.45,18.21 | U$3.GND 29.34,37.34 30.61,38.61 30.61,46.23 34.42,50.04 U$3.~CE1 | v16,30.1 v16,57.02 v16,79.88 | U$25.GND 78.23,59.06 76.33,57.15 C3.- 77.22,55.12 77.22,50.8 75.18,48.77 C11.2 | C5.2 1.32,54.48 | 1.32,54.48 C6.2 | U$2.GND 1.32,54.48 | 51.82,14.35 C2.2 | 51.82,14.35 52.58,15.11 U$1.GND.1 | ISP.6 51.31,10.41 C12.- 51.82,14.35 | 85.5,36.22 C14.2 91.31,41.76 91.31,43.69 97.54,49.91 U$30.P$2 | 89.23,26.97 SG1.- | U$39.3 23.38,8.75 25.78,6.35 U$10.VSS 27.81,6.35 30.35,3.81 JMP1.2 | C10.2 75.18,44.17 C11.2 | C11.2 74.93,48.39 IC2.10
  pour Top (isolate 0.254): 74.17,89.66 74.17,79.63 46.74,79.63 46.74,89.66
  pour Top (isolate 0.254): 22.99,8.38 22.1,8.38 22.1,4.45 10.16,4.45 10.16,8.38 9.27,8.38 9.27,12.32 22.99,12.32
  pour Top (isolate 0.305): 90.55,13.46 90.55,4.95 81.66,4.95 81.66,13.6
  pour Top (isolate 0.254): 81.66,89.53 90.3,89.66 90.3,86.49 89.53,86.36 89.53,78.74 82.42,78.74 82.42,86.49 81.66,86.36
GREEN
  Top 0.406: U$40.2 58.42,79.37 59.18,78.61 60.58,78.61 61.34,77.85 61.34,68.83 | 61.34,68.83 U$13.P$2 63.04,68.78 63.04,67.26 U$5.P$2 | 61.34,68.83 U$14.P$2 59.64,67.74 U$7.P$2
HSYNC
  Bottom 0.406: U$40.13 60.71,86.35 59.94,87.12 48.01,87.12 45.09,84.2 15.37,84.07 6.1,74.8 U$2.PB2
N$1
  Bottom 0.457: U$1.XTAL1 arc-45 43.88,30.42 41.46,28 arc-45 34.27,25.02 QG1.8 17.01,25.02 arc-45 13.77,26.36 12.77,27.36 arc-45 11.43,30.6 11.43,46.57 arc45 10.69,48.37 10.4,48.66 arc45 8.6,49.4 U$2.XTAL1
N$2
  Top 0.406: U$17.CA 49.1,70.18 51.18,72.26 U$12.P$1
N$3  (via drill 0.5)
  Top 0.305: U$3.~OE 41.4,55.12 34.93,61.59 34.93,65.66 v38.35,69.09 | v34.29,73.03 36.96,75.69 36.96,82.17 40.72,85.93 IC4.2
  Bottom 0.305: v38.35,69.09 v34.29,73.03
N$4
  Top 0.61: U$1.PA7 57.66,5.46 57.79,5.21 GPIO.1
N$5
  Top 0.305: U$3.A16 25.53,72.9 24.89,73.53 12.83,73.53 6.48,79.88 U$2.PB0
N$6  (via drill 0.5)
  Top 0.305: U$2.PB3 8.64,72.26 9.91,70.99 24.76,70.99 25.4,71.63 30.35,71.63 v31.37,70.61 | v37.08,54.99 v37.08,48.77 | IC2.19 51.05,53.85 48.64,51.44 48.64,48.51 IC2.1
  Bottom 0.305: v31.37,70.61 32.77,70.61 37.08,66.29 v37.08,54.99 | v37.08,48.77 46.1,48.77 46.74,49.4 48.01,49.4 48.51,48.89 IC2.1
N$7
  Bottom 0.813: C5.1 4.37,51.84 U$2.XTAL2
N$8  (via drill 0.5)
  Top 0.305: U$2.PB5 16.26,67.18 17.53,65.91 24.89,65.91 25.53,66.55 29.97,66.55 v31.24,67.82 | U$3.CE2 36.32,70.36 v33.78,67.82 33.78,44.83 v35.05,43.56
  Bottom 0.305: v31.24,67.82 v33.78,67.82 | v35.05,43.56 40.01,38.61 48.26,38.61 48.51,38.35 IC3.1
N$9
  Bottom 0.813: U$32.P$1 U$31.P$2 95.5,77.34 88.77,84.07 82.42,84.07 80.9,85.6 C13.+
N$10
  Top 0.305: U$2.PB4 8.64,69.72 9.91,68.45 24.76,68.45 25.4,69.09 32.13,69.09 40.51,77.47 45.59,77.47 | IC4.1 43.26,85.9 44.96,84.2 44.96,78.99 45.59,78.36 45.59,77.47 | 45.59,77.47 45.59,68.58 44.83,67.82 U$3.R/W
N$11  (via drill 0.6)
  Top 0.305: C10.1 74.45,37.49 71.63,34.67 71.63,31.5 61.72,21.59 v50.93,21.59
  Bottom 0.305: U$1.XTAL2 47.5,31.37 50.93,27.94 v50.93,21.59
N$12
  Top 0.406: U$11.P$1 55.63,77.34 U$18.CA
N$13
  Top 0.406: U$19.CA 58.04,68.5 58.04,74.93 59.56,76.45 U$14.P$1
N$14
  Top 0.406: U$13.P$1 63.88,77.34 U$20.CA
N$15
  Top 0.406: U$21.CA 66.55,68.38 66.55,75.44 U$16.P$1
N$16
  Top 0.406: U$15.P$1 72.01,77.34 U$22.CA
N$17
  Bottom 0.813: S3.5 S3.2 89.66,15.37 87.12,15.37 86.11,14.35 JP2.PWR
N$18
  Bottom 0.406: SG1.+ 85.34,31.11 89.92,31.11 92.2,33.4 92.2,36.07 94.11,37.97 96.27,37.97 97.16,38.86 97.16,43.43 S1.1
N$19
  Bottom 0.406: U$24.P$2 78.23,29.85 80.9,32.51 89.03,32.51 90.81,34.29 90.81,36.58 93.98,39.75 S1.3
N$20
  Top 0.406: U$24.P$1 77.34,15.75 LED1.A
N$21
  Bottom 0.406: S1.2 94.49,42.29 89.92,37.72 89.92,34.92 88.52,33.53 78.36,33.53 76.96,34.67 75.95,34.67 75.44,34.16 U$1.PB0
N$22
  Top 0.406: U$1.PD0 42.42,31.37 30.99,19.94 30.99,11.3 30.35,10.67 30.35,5.97 32.89,3.43 JMP1.1
N$23
  Bottom 0.406: U$6.P$1 53.59,57.15 IC2.18
N$24
  Bottom 0.406: U$4.P$1 56.13,58.04 IC2.17
N$25
  Bottom 0.406: U$7.P$1 58.67,57.53 IC2.16
N$26
  Bottom 0.406: U$5.P$1 61.21,57.15 IC2.15
N$27
  Bottom 0.406: IC2.14 63.75,56.77 65.15,58.17 66.42,58.17 U$9.P$1
N$28
  Bottom 0.406: U$8.P$1 70.1,58.8 70.1,54.36 69.34,53.59 67.06,53.59 66.29,54.36 IC2.13
N$29
  Top 0.406: U$21.AN 65.61,59.11 66.55,58.17 67.82,58.17 68.83,57.15 IC2.12
  Bottom 0.406: U$17.AN 49.1,60.78 50.04,61.72 56.9,61.72 | 56.9,61.72 64.77,61.72 65.66,60.83 65.66,59.87 U$21.AN | U$19.AN 57.1,61.52 56.9,61.72
N$30
  Bottom 0.406: U$18.AN 56.64,70.87 57.66,71.88 65.28,71.88 | 65.28,71.88 72.26,71.88 73.28,70.87 73.28,69.77 U$22.AN 73.23,58.75 71.37,56.9 IC2.11 | U$20.AN 65.15,71.76 65.28,71.88
N$31
  Bottom 0.406: U$32.P$2 93.22,74.68 95.88,72.01 U$33.P$2
  Bottom 0.813: U$33.P$2 U$26.P$1
N$32
  Top 0.406: U$34.P$2 94.23,66.17 91.57,63.5 U$27.P$1
  Bottom 0.406: U$26.P$2 91.57,68.83 92.46,67.95 92.46,64.39 91.57,63.5 U$27.P$1
N$33
  Bottom 0.406: U$28.P$1 93.22,57.66 95.88,60.33 U$35.P$2
  Bottom 0.813: U$27.P$2 U$35.P$2
N$34
  Bottom 0.813: U$28.P$2 U$36.P$2 U$29.P$1
N$35
  Top 0.406: U$37.P$2 96.9,48.01 94.49,50.42 U$30.P$1
  Bottom 0.813: U$30.P$1 U$29.P$2
N$36
  Bottom 0.406: U$25.PC5/ADC5 90.17,76.84 U$31.P$1
N$37
  Bottom 0.406: U$33.P$1 90.68,72.39 88.77,74.3 U$25.PC4/ADC4
N$38
  Top 0.406: U$25.PC3/ADC3 88.52,71.76 89.79,70.48 91.69,70.48 92.46,69.72 92.46,67.18 91.44,66.17 U$34.P$1
N$39
  Bottom 0.406: U$35.P$1 90.6,60.2 92.96,60.2 93.6,60.83 93.6,69.09 92.2,70.48 89.92,70.48 88.65,69.22 U$25.PC2/ADC2
N$40
  Bottom 0.406: U$25.PC1/ADC1 86.36,66.67 85.47,65.79 85.47,56.01 86.23,55.25 U$36.P$1
N$41  (via drill 0.5)
  Top 0.406: U$25.PC0/ADC0 88.65,64.14 88.65,63.37 90.17,61.85 93.22,61.85 94.62,60.45 v94.62,56.52
  Bottom 0.406: v94.62,56.52 94.62,50.04 92.58,48.01 U$37.P$1
N$42
  Top 0.61: U$38.P$1 U$25.PC6/RESET
N$43
  Top 0.305: U$25.PB6 82.42,56.52 83.82,55.12 83.82,42.67 XTAL.1
  Top 0.61: XTAL.1 88.04,38.46 C14.1
N$44
  Top 0.305: XTAL.2 82.55,40.89 82.55,53.21 81.79,53.98 U$25.PB7
  Top 0.61: C15.1 80.11,38.46 XTAL.2
N$45
  Bottom 0.813: U$1.AREF 55.12,16.13 56.26,14.99 C2.1
N$46
  Top 0.406: 3.56,77.34 2.67,77.34 2.16,77.85
N$47
  Top 0.406: U$1.PD1 39.88,32.13 28.45,20.7 28.45,4.06 27.81,3.43 JMP1.3
N$48
  Top 0.305: U$10.SCK 39.62,8.89 42.04,6.48 44.83,6.48 ISP.3
  Bottom 0.305: U$1.PB7 57.66,25.53 61.47,21.72 61.47,13.84 57.91,10.29 56.13,10.29 49.53,3.68 47.62,3.68 ISP.3
N$49
  Bottom 0.406: U$1.PB2 70.36,30.35 73.66,27.05 73.66,24.13 75.95,21.84 79.76,21.84 87.12,29.21 91.57,29.21 S2.2
N$50  (via drill 0.5)
  Top 0.305: v54.86,7.62 50.42,3.18 45.85,3.18 43.82,5.21 ISP.1 38.48,5.21 v36.07,7.62
  Bottom 0.305: U$1.PB6 60.2,24.76 64.01,20.95 64.01,14.73 58.17,8.89 56.13,8.89 v54.86,7.62 | U$10.SO 27.56,11.43 31.37,7.62 v36.07,7.62
N$51  (via drill 0.5)
  Top 0.305: v56.51,7.62 54.74,9.4 47.5,9.4 46.1,8 ISP.4 43.69,10.16 32.51,10.16 31.75,9.4 31.75,6.98 32.38,6.35 U$10.SI
  Bottom 0.305: U$1.PB5 62.74,24.13 66.55,20.32 66.55,13.72 60.45,7.62 v56.51,7.62
N$52  (via drill 0.5)
  Top 0.305: v70.74,24.89 v67.44,24.89 | v78.23,6.98 78.23,2.54 76.71,1.02 55.75,1.02 54.23,2.54 41.53,2.54 v40.01,4.06
  Bottom 0.305: v78.23,6.98 71.63,13.59 71.63,24 v70.74,24.89 | v67.44,24.89 65.28,27.05 U$1.PB4 | U$10.~CS 27.56,13.97 31.37,10.16 36.32,10.16 40.01,6.48 v40.01,4.06
N$53  (via drill 0.5)
  Top 0.305: U$10.~HOLD v39.24,11.43
  Bottom 0.305: U$1.PB3 67.82,30.86 69.09,29.59 69.09,13.59 62.1,6.6 55.75,6.6 52.07,2.92 43.69,2.92 41.27,5.33 41.27,9.52 39.37,11.43 v39.24,11.43
N$54
  Top 0.61: U$1.PA6 60.2,5.33 60.32,5.08 GPIO.2
N$55
  Top 0.61: U$1.PA5 62.74,5.46 62.87,5.21 GPIO.3
N$56
  Top 0.61: U$1.PA4 65.28,5.46 65.41,5.21 GPIO.4
N$57
  Top 0.61: U$1.PA3 67.82,5.46 67.94,5.21 GPIO.5
N$58
  Top 0.61: U$1.PA2 70.36,5.59 70.48,5.33 GPIO.6
N$59
  Top 0.61: U$1.PA1 72.9,5.59 73.03,5.33 GPIO.7
N$60
  Top 0.61: U$1.PA0 75.44,5.46 75.56,5.21 GPIO.8
N$61
  Bottom 0.305: U$1.~RESET 55.12,26.67 58.93,22.86 58.93,12.83 57.66,11.56 54.99,11.56 ISP.5
N$62
  Top 0.406: 3.43,74.8 2.67,74.8 2.16,74.3
N$64
  Bottom 0.813: S3.4 S3.1 U$23.P$2 89.15,23.5 86.61,20.95 86.61,18.97 Q1.D
N$69
  Top 0.813: U$23.P$1 95.63,15.88 97.28,14.22 D1.A
PS2_CLOCK
  Top 0.305: U$39.5 19.53,17.62 30.23,28.32 34.29,28.32 37.34,31.37 U$1.PD2
PS2_DATA
  Top 0.305: U$39.1 17.43,17.3 29.59,29.46 32.89,29.46 34.8,31.37 U$1.PD3
RED
  Top 0.406: 53.09,68.83 U$12.P$2 51.43,68.58 U$6.P$2 | 53.09,68.83 U$11.P$2 54.86,68.45 U$4.P$2 | U$40.1 56.13,79.37 55.37,78.61 53.85,78.61 52.83,77.6 52.83,69.09 53.09,68.83
TO_CPU
  Top 0.305: U$1.PD4 32.26,31.88 31.62,31.24 27.81,31.24 27.18,32 U$1.PD6
  Bottom 0.305: U$1.PD6 27.18,31.5 24.51,28.83 15.49,28.83 13.97,30.35 13.97,56.52 11.3,59.06 5.71,64.64 U$2.PB6 | U$1.PD4 32.26,34.54 32.77,35.05 46.86,35.05 46.99,34.92 71.88,34.92 72.9,35.94 72.9,39.12 75.31,41.53 88.9,41.53 89.79,42.42 89.79,45.47 88.9,46.36 U$25.PB2/SS
VCC  (via drill 0.6)
  Top 0.508: IC3.20 48.51,44.96 47.12,46.36 47.12,52.07 48.51,53.47 IC2.20
  Top 0.813: U$1.VCC 52.58,31.62 50.8,29.85 48.26,29.85 v47.24,28.83 | v8.89,47.12 v8.89,53.85 9.52,54.48 U$2.AVCC 22.4,54.48 C9.+ | v84.45,59.06 U$25.AREF U$25.AVCC 86.11,56.52 84.96,55.37 84.96,43.31 86.49,41.78 88.52,41.78 90.55,39.75 90.45,34.61 84.05,28.21 84.05,19 Q1.S | U$2.VCC 5.71,57.02 9.65,60.96 v9.65,63.63 | U$10.VCC 46.1,13.97 C12.+ | U$25.VCC 78.87,61.59 77.72,60.45 77.72,54.74 76.71,53.72 C11.1
  Bottom 0.813: U$39.4 11.31,8.75 8.89,11.18 8.89,13.97 | 8.89,13.97 8.89,25.02 | QG1.14 8.89,25.02 | 8.89,25.02 v8.89,47.12 | v84.45,59.06 81.91,61.59 U$25.VCC C3.+ | C3.+ 75.95,61.59 | 23.62,82.93 42.04,82.93 43.26,81.71 IC4.14 U$3.VDD 45.97,75.44 C8.+ 45.59,72.52 45.59,58.93 IC2.20 48.51,54.48 50.42,52.58 74.04,52.58 C11.1 | 23.62,82.93 16.64,82.93 9.65,75.95 v9.65,63.63 | C6.1 4.02,57.02 U$2.VCC 7.11,57.02 8.89,55.25 v8.89,53.85 | C1.1 23.62,82.93 | 34.16,13.97 U$10.VCC 29.59,13.97 28.19,15.37 23.49,15.37 22.23,14.1 9.02,14.1 8.89,13.97 | C3.+ 75.82,68.07 U$38.P$2 | ISP.2 43.56,11.18 C12.+ 47.62,13.84 50.04,16.38 U$1.AVCC 50.04,20.19 47.24,22.99 v47.24,28.83
VSYNC
  Bottom 0.406: U$40.14 62.99,85.48 62.99,86.36 61.21,88.14 46.86,88.14 43.82,85.09 13.84,85.09 6.1,77.34 U$2.PB1
(copper drawn outside any net)
  shapes: Top area x3

### Text on the board
tPlace: created for / deltahacker / magazine
bPlace: MONITOR | SPK | APU | VRAM | GPU | CPU
tNames: VS | HS | GND | LED/BUZ | BREAK | 22pF | 22pF | ON | OFF | deltahacker.gr | 23LC1024 | 8 | 1 | TX | RX
bNames: VIDEO DAC | AUDIO | DAC | dHPC | SYSTEM | by spir@l evolut10n | CLOCK | deltahacker.gr | SRAM | 2 | 8 | GPIO | 1 | 1 | POWER | KEYBOARD
tValues: 100nF | Oct / 2016 | 6.8uF | 6.8uF | 6.8uF | 100nF | 100nF | BUZZER | 20MHz | 6.8uF | 100nF